# EAGLE schematic 2020can_master_v1 (EAGLE 9.5.2)
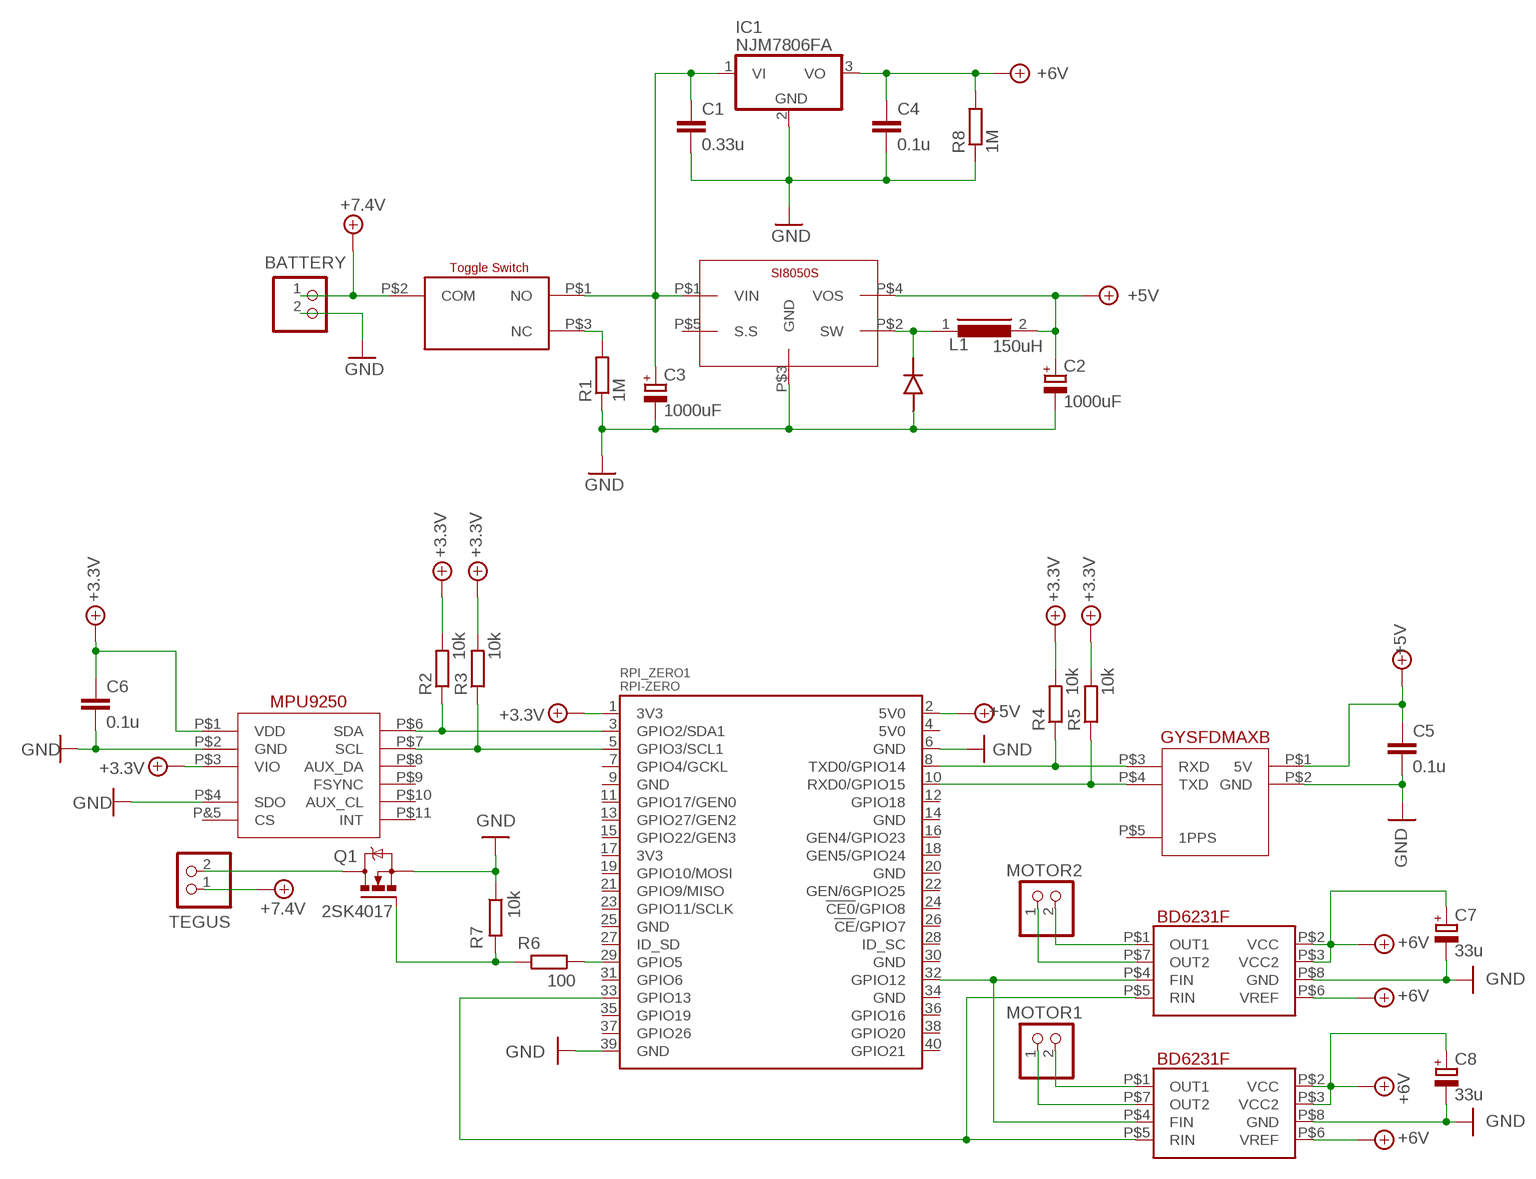
[diagram p0: schematic, sheet 1]

## Parts
BATTERY  B2P-VH  [B2P-VH]
BD6231F1  BD6231F  [BD62**_SOP8]
BD6231F2  BD6231F  [BD62**_SOP8]
C1  0.33u  C5/3  [C5B3]
C2  1000uF  CPOL-EUE5-10.5  [E5-10,5]
C3  1000uF  CPOL-EUE5-10.5  [E5-10,5]
C4  0.1u  C5/3  [C5B3]
C5  0.1u  C5/3  [C5B3]
C6  0.1u  C5/3  [C5B3]
C7  33u  CPOL-EUE2,5-6E  [E2,5-6E]
C8  33u  CPOL-EUE2,5-6E  [E2,5-6E]
DIODE_1.1  DIODE_1.5  [DIODE_1.5]
GYSFDMAXB1  GYSFDMAXB  [GYSFDMAXB]
IC1  NJM7806FA  786TV  [TO220V]
L1  150uH  SFT830D  [SFT830D]
MOTOR1  B2P-VH  [B2P-VH]
MOTOR2  B2P-VH  [B2P-VH]
MPU1  MPU9250  [MPU9250]
Q1  2SK4017  IRF530  [TO220BV]
R1  1M  R-EU_0207/10  [0207/10]
R2  10k  R-EU_0207/10  [0207/10]
R3  10k  R-EU_0207/10  [0207/10]
R4  10k  R-EU_0207/10  [0207/10]
R5  10k  R-EU_0207/10  [0207/10]
R6  100  R-EU_0207/10  [0207/10]
R7  10k  R-EU_0207/10  [0207/10]
R8  1M  R-EU_0207/10  [0207/10]
RPI_ZERO1  RPI-ZERO  [RASP_PI_ZERO_BOARD_FULL]
SI8050S1  SI8050S  [SI8050S]
SWITCH_2MS1T2B4M2QES1  SWITCH_2MS1T2B4M2QES  [SWITCH_2MS1T2B4M2QES]
TEGUS  B2P-VH  [B2P-VH]

## Nets
+4.1V [power]: C6.1 MPU1.P$1(VDD) MPU1.P$3(VIO) R2.2 R3.2 R4.2 R5.2 RPI_ZERO1.1(3V3) ; supply symbol labelled +3.3V
+5V [power]: C2.+ C5.1 GYSFDMAXB1.P$1(5V) L1.2 RPI_ZERO1.2(5V0) SI8050S1.P$4(VOS)
+7V [power]: BD6231F1.P$2(VCC) BD6231F1.P$3(VCC2) BD6231F1.P$6(VREF) BD6231F2.P$2(VCC) BD6231F2.P$3(VCC2) BD6231F2.P$6(VREF) C4.1 C7.+ C8.+ IC1.3(VO) R8.2 ; supply symbol labelled +6V
+8V [power]: BATTERY.1 SWITCH_2MS1T2B4M2QES1.P$2(COM) TEGUS.1 ; supply symbol labelled +7.4V
GND: Q1.S R7.1
MOS_+: Q1.D TEGUS.2
MOS_GND [power]: BATTERY.2 BD6231F1.P$8(GND) BD6231F2.P$8(GND) C1.2 C2.- C3.- C4.2 C5.2 C6.2 C7.- C8.- DIODE_1.1.P$1(ANODE) GYSFDMAXB1.P$2(GND) IC1.2(GND) MPU1.P$2(GND) MPU1.P$4(SDO) R1.1 R8.1 RPI_ZERO1.6(GND) RPI_ZERO1.39(GND) SI8050S1.P$3(GND) ; supply symbol labelled GND
N$1 [power]: R1.2 SWITCH_2MS1T2B4M2QES1.P$3(NC)
N$2: DIODE_1.1.P$2(CATHODE) L1.1 SI8050S1.P$2(SW)
N$3: MPU1.P$6(SDA) R2.1 RPI_ZERO1.3(GPIO2/SDA1)
N$4 [power]: C1.1 C3.+ IC1.1(VI) SI8050S1.P$1(VIN) SWITCH_2MS1T2B4M2QES1.P$1(NO)
N$5: BD6231F1.P$4(FIN) BD6231F2.P$4(FIN) RPI_ZERO1.32(GPIO12)
N$6: MPU1.P$7(SCL) R3.1 RPI_ZERO1.5(GPIO3/SCL1)
N$7: GYSFDMAXB1.P$3(RXD) R4.1 RPI_ZERO1.8(TXD0/GPIO14)
N$8: GYSFDMAXB1.P$4(TXD) R5.1 RPI_ZERO1.10(RXD0/GPIO15)
N$10: BD6231F1.P$5(RIN) BD6231F2.P$5(RIN) RPI_ZERO1.33(GPIO13)
N$11 [power]: BD6231F1.P$1(OUT1) MOTOR2.2
N$12 [power]: BD6231F1.P$7(OUT2) MOTOR2.1
N$13 [power]: BD6231F2.P$1(OUT1) MOTOR1.2
N$14 [power]: BD6231F2.P$7(OUT2) MOTOR1.1
N$16: Q1.G R6.2 R7.2
N$17: R6.1 RPI_ZERO1.29(GPIO5)
Unconnected: GYSFDMAXB1.P$5(1PPS) MPU1.P$8(AUX_DA) MPU1.P$9(FSYNC) MPU1.P$10(AUX_CL) MPU1.P$11(INT) MPU1.P&5(CS) RPI_ZERO1.4(5V0) RPI_ZERO1.7(GPIO4/GCKL) RPI_ZERO1.9(GND) RPI_ZERO1.11(GPIO17/GEN0) RPI_ZERO1.12(GPIO18) RPI_ZERO1.13(GPIO27/GEN2) RPI_ZERO1.14(GND) RPI_ZERO1.15(GPIO22/GEN3) RPI_ZERO1.16(GEN4/GPIO23) RPI_ZERO1.17(3V3) RPI_ZERO1.18(GEN5/GPIO24) RPI_ZERO1.19(GPIO10/MOSI) RPI_ZERO1.20(GND) RPI_ZERO1.21(GPIO9/MISO) RPI_ZERO1.22(GEN/6GPIO25) RPI_ZERO1.23(GPIO11/SCLK) RPI_ZERO1.24(!CE0!/GPIO8) RPI_ZERO1.25(GND) RPI_ZERO1.26(!CE!/GPIO7) RPI_ZERO1.27(ID_SD) RPI_ZERO1.28(ID_SC) RPI_ZERO1.30(GND) RPI_ZERO1.31(GPIO6) RPI_ZERO1.34(GND) RPI_ZERO1.35(GPIO19) RPI_ZERO1.36(GPIO16) RPI_ZERO1.37(GPIO26) RPI_ZERO1.38(GPIO20) RPI_ZERO1.40(GPIO21) SI8050S1.P$5(S.S)

## Library data of the parts
BATTERY MOTOR1 MOTOR2 TEGUS = CONN_VH:B2P-VH: Wire-to-Board 3.96mm pitch top mount connector Source: http://www.jst-mfg.com/product/pdf/jpn/VH.pdf http://www.jst-mfg.com/product/detail.php?series=262
BD6231F1 BD6231F2 = BD62**:BD6231F: BD6231F; Full Bridge DC Motor Driver; 6V~32V; MAX 1A; http://akizukidenshi.com/catalog/g/gI-05088/
C1 C4-C6 = capacitor-wima:C: CAPACITOR naming: grid - package width
C2 C3 = resistor:CPOL-EU: POLARIZED CAPACITOR, European symbol
C7 C8 = rcl:CPOL-EU: POLARIZED CAPACITOR, European symbol; SPICEPREFIX: C
DIODE_1.1 = diode_1.5mm:DIODE_1.5
GYSFDMAXB1 = GYSFDMAXB:GYSFDMAXB: module with GPS "Michibiki"; http://akizukidenshi.com/catalog/g/gK-09991/
IC1 = linear:78*: Positive VOLTAGE REGULATOR Source: http://cache.national.com/ds/LM/LM78L05.pdf http://www.fairchildsemi.com/ds/LM/LM7805.pdf
L1 = inductors:SFT830D: INDUCTOR; SPICEPREFIX: L
MPU1 = MPU9250:MPU9250: a module of MPU9250 IMU sensor; https://learn.sparkfun.com/tutorials/mpu-9250-hookup-guide?_ga=1.139382715.926858641.1470020364
Q1 = transistor-power:IRF530: HEXFET Power MOSFET
R1-R8 = rcl:R-EU_: RESISTOR, European symbol; SPICEPREFIX: R
RPI_ZERO1 = RaspberryPi_Zero:RPI-ZERO: MICON
SI8050S1 = SI-8050S:SI8050S
SWITCH_2MS1T2B4M2QES1 = switch_2MS1T2B4M2QES:SWITCH_2MS1T2B4M2QES

## Net classes
0 default: width 0.75 mm, clearance 0.5 mm
1 power: width 1.5 mm, clearance 0.5 mm
2 mos: width 0.5 mm, clearance 0.2 mm